# Altium schematic sheet StrongPCB_mixed.SchDoc
size A2
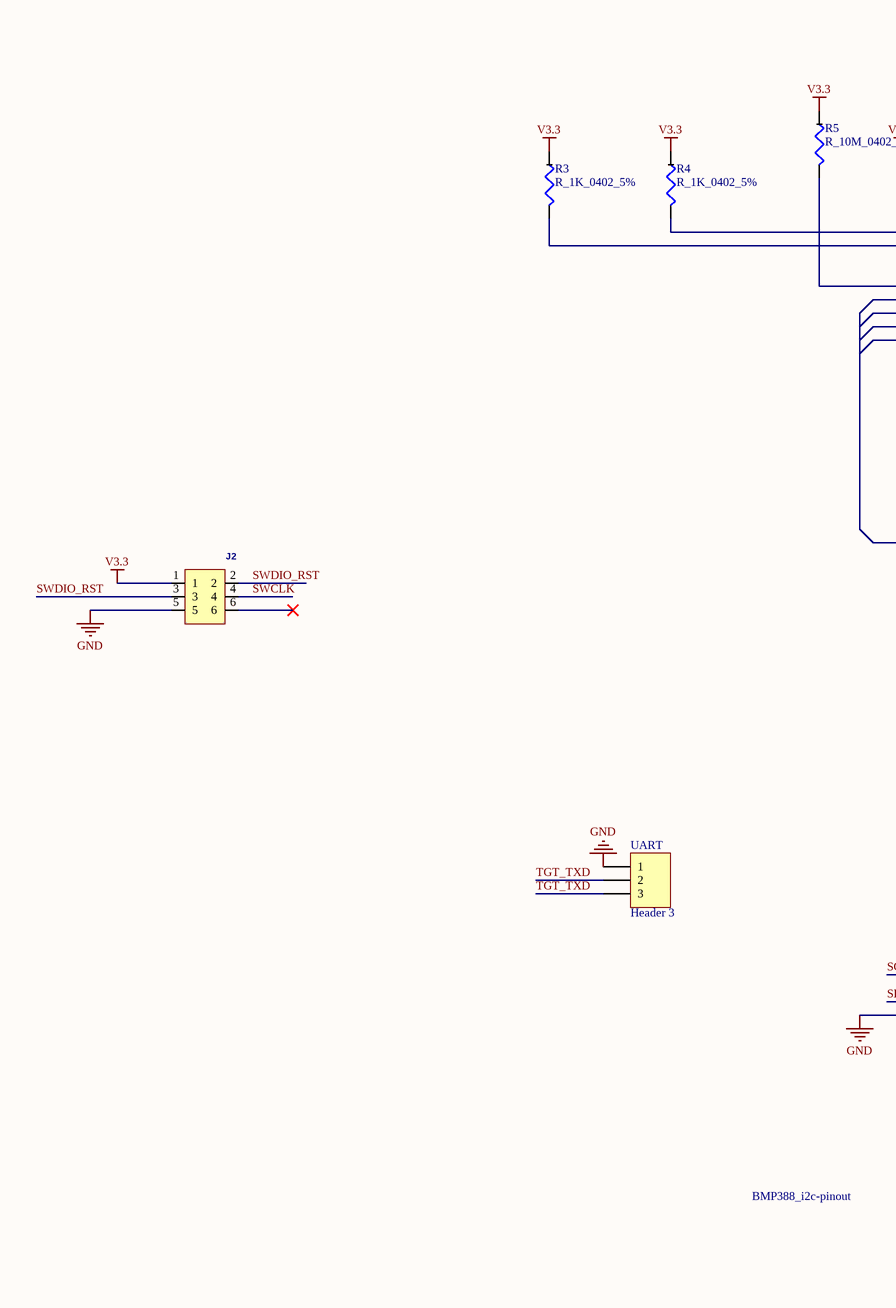
[diagram p0: StrongPCB_mixed.SchDoc, left]
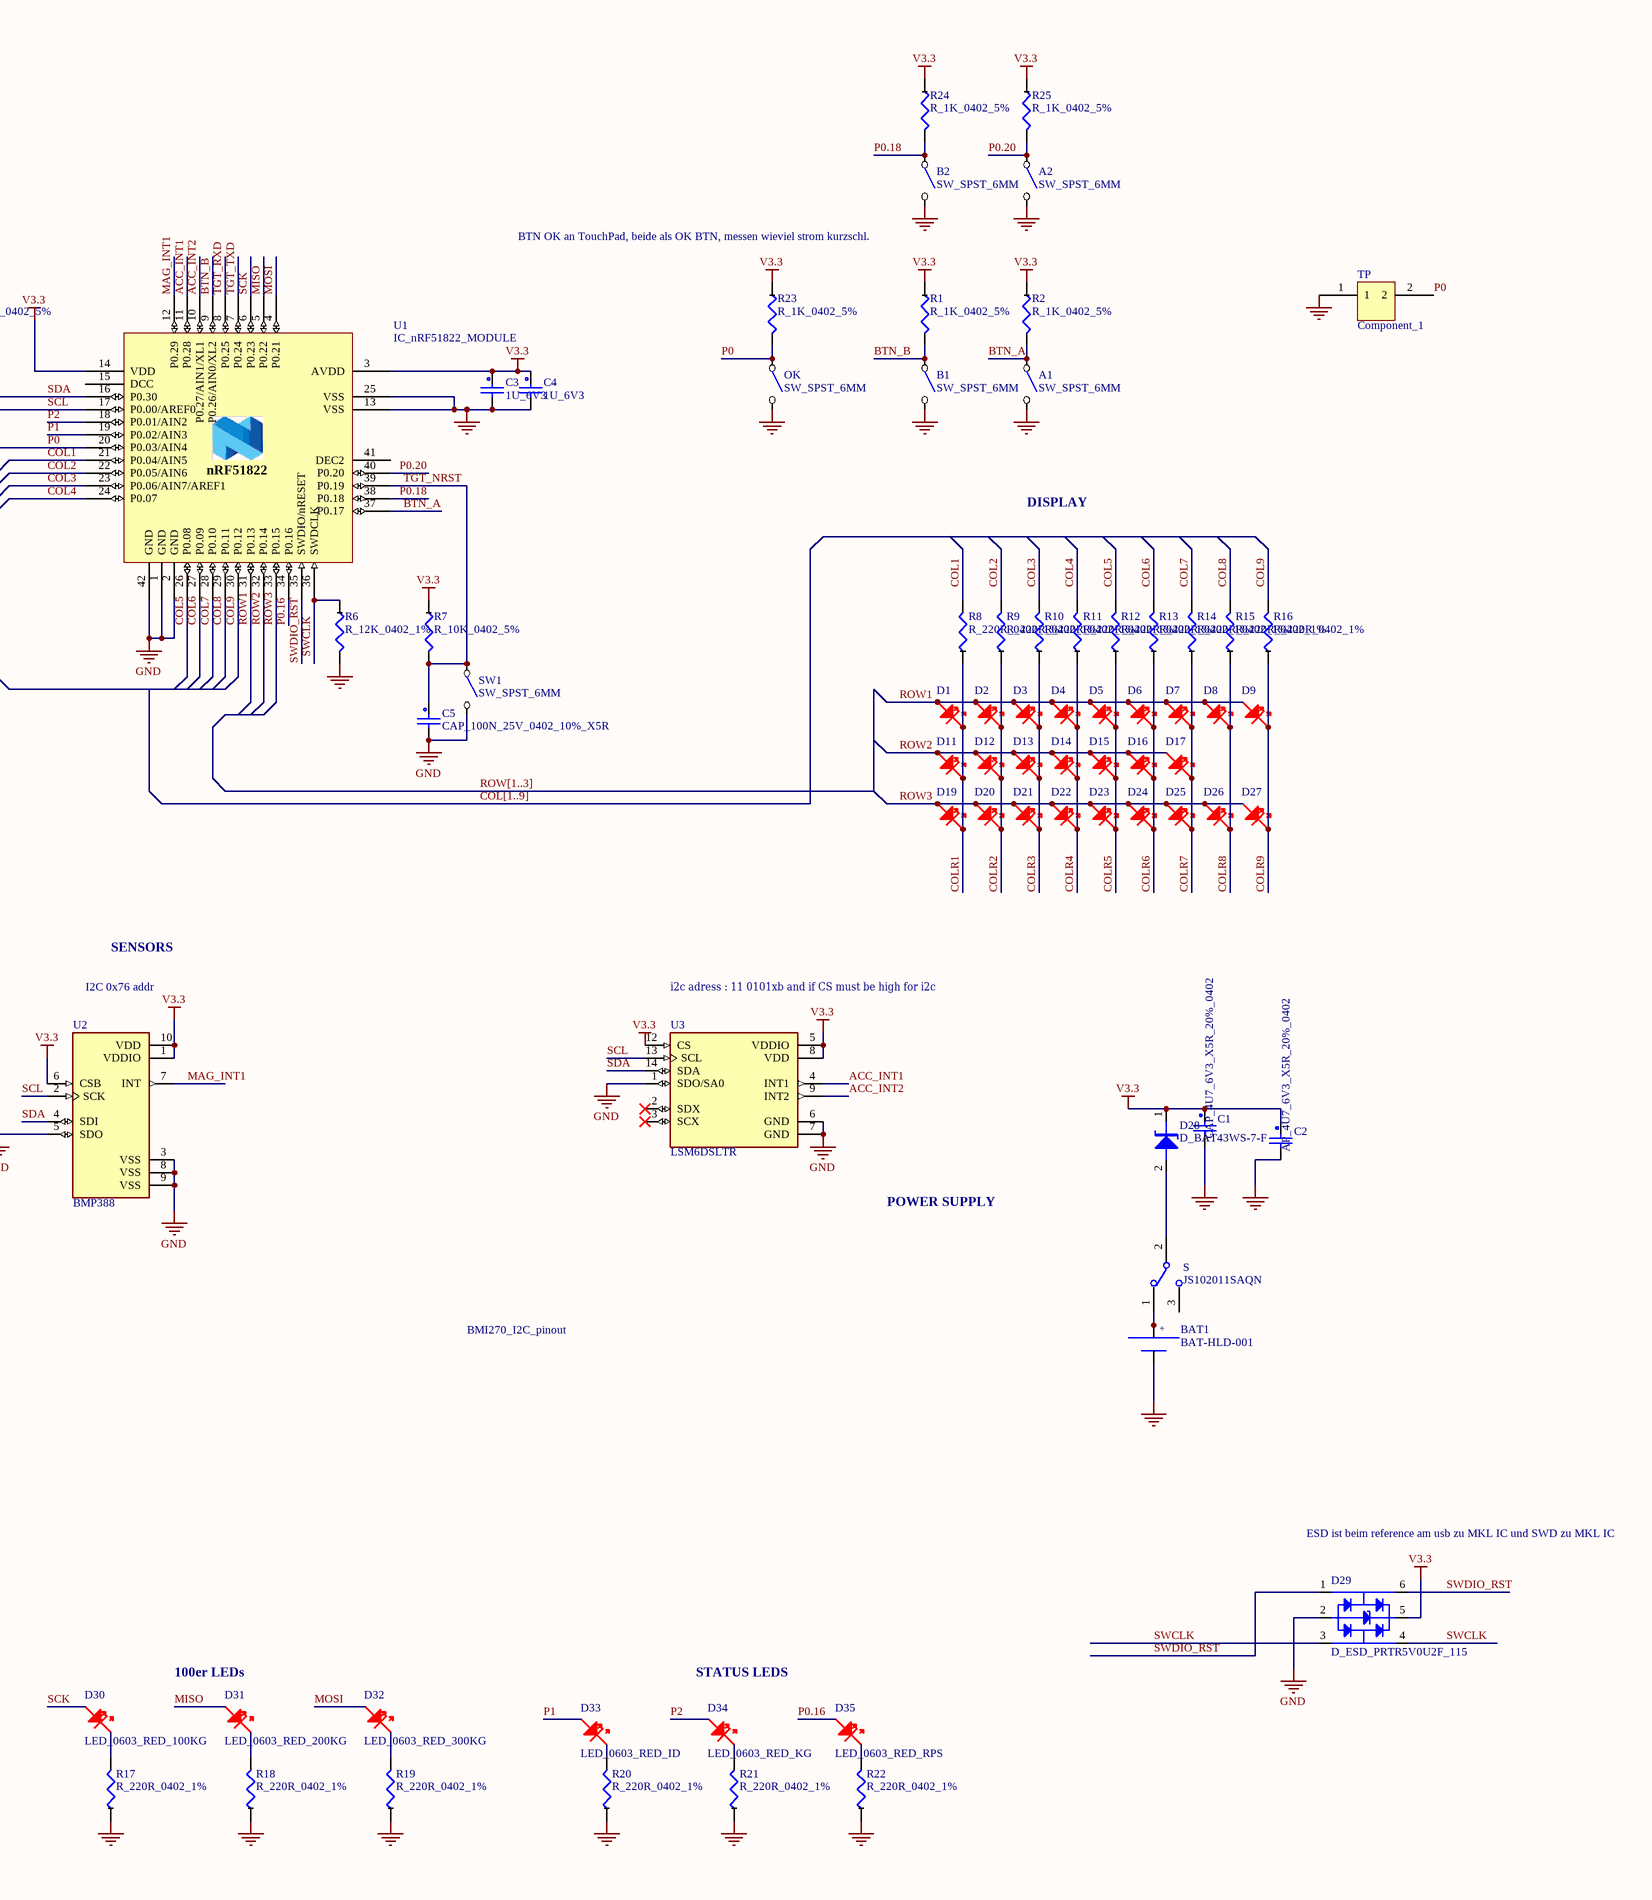
[diagram p1: StrongPCB_mixed.SchDoc, right]

## Parts
A1  SW_SPST_6MM  [SW_FSM4JSMA]
A2  SW_SPST_6MM  [SW_FSM4JSMA]
B1  SW_SPST_6MM  [SW_FSM4JSMA]
B2  SW_SPST_6MM  [SW_FSM4JSMA]
BAT1  BAT-HLD-001  [BAT-HLD-001]
C1  CAP_4U7_6V3_X5R_20%_0402  [c_0402]
C2  AP_4U7_6V3_X5R_20%_0402  [c_0402]
C3  1U_6V3  [C_0402]
C4  1U_6V3  [C_0402]
C5  CAP_100N_25V_0402_10%_X5R  [C_0402]
D1  LED_0603_RED  [LED_0603_RED]  (value not drawn)
D2  LED_0603_RED  [LED_0603_RED]  (value not drawn)
D3  LED_0603_RED  [LED_0603_RED]  (value not drawn)
D4  LED_0603_RED  [LED_0603_RED]  (value not drawn)
D5  LED_0603_RED  [LED_0603_RED]  (value not drawn)
D6  LED_0603_RED  [LED_0603_RED]  (value not drawn)
D7  LED_0603_RED  [LED_0603_RED]  (value not drawn)
D8  LED_0603_RED  [LED_0603_RED]  (value not drawn)
D9  LED_0603_RED  [LED_0603_RED]  (value not drawn)
D11  LED_0603_RED  [LED_0603_RED]  (value not drawn)
D12  LED_0603_RED  [LED_0603_RED]  (value not drawn)
D13  LED_0603_RED  [LED_0603_RED]  (value not drawn)
D14  LED_0603_RED  [LED_0603_RED]  (value not drawn)
D15  LED_0603_RED  [LED_0603_RED]  (value not drawn)
D16  LED_0603_RED  [LED_0603_RED]  (value not drawn)
D17  LED_0603_RED  [LED_0603_RED]  (value not drawn)
D19  LED_0603_RED  [LED_0603_RED]  (value not drawn)
D20  LED_0603_RED  [LED_0603_RED]  (value not drawn)
D21  LED_0603_RED  [LED_0603_RED]  (value not drawn)
D22  LED_0603_RED  [LED_0603_RED]  (value not drawn)
D23  LED_0603_RED  [LED_0603_RED]  (value not drawn)
D24  LED_0603_RED  [LED_0603_RED]  (value not drawn)
D25  LED_0603_RED  [LED_0603_RED]  (value not drawn)
D26  LED_0603_RED  [LED_0603_RED]  (value not drawn)
D27  LED_0603_RED  [LED_0603_RED]  (value not drawn)
D28  D_BAT43WS-7-F  [SOD323]
D29  D_ESD_PRTR5V0U2F_115  [SOT886]
D30  LED_0603_RED_100KG  [LED_0603_RED]
D31  LED_0603_RED_200KG  [LED_0603_RED]
D32  LED_0603_RED_300KG  [LED_0603_RED]
D33  LED_0603_RED_ID  [LED_0603_RED]
D34  LED_0603_RED_KG  [LED_0603_RED]
D35  LED_0603_RED_RPS  [LED_0603_RED]
J2  Sockets & Adapters J-Link 6-pin Needle Adapter   Source:  Datasheet  [J-Link 6-pin Needle Adapter no legs]  (value not drawn)
OK  SW_SPST_6MM  [SW_FSM4JSMA]
R1  R_1K_0402_5%  [R_0402]
R2  R_1K_0402_5%  [R_0402]
R3  R_1K_0402_5%  [R_0402]
R4  R_1K_0402_5%  [R_0402]
R5  R_10M_0402_5%  [R_0402]
R6  R_12K_0402_1%  [R_0402]
R7  R_10K_0402_5%  [R_0402]
R8  R_220R_0402_1%  [R_0402]
R9  R_220R_0402_1%  [R_0402]
R10  R_220R_0402_1%  [R_0402]
R11  R_220R_0402_1%  [R_0402]
R12  R_220R_0402_1%  [R_0402]
R13  R_220R_0402_1%  [R_0402]
R14  R_220R_0402_1%  [R_0402]
R15  R_220R_0402_1%  [R_0402]
R16  R_220R_0402_1%  [R_0402]
R17  R_220R_0402_1%  [R_0402]
R18  R_220R_0402_1%  [R_0402]
R19  R_220R_0402_1%  [R_0402]
R20  R_220R_0402_1%  [R_0402]
R21  R_220R_0402_1%  [R_0402]
R22  R_220R_0402_1%  [R_0402]
R23  R_1K_0402_5%  [R_0402]
R24  R_1K_0402_5%  [R_0402]
R25  R_1K_0402_5%  [R_0402]
S  JS102011SAQN  [SW_JS102011SAQN]
SW1  SW_SPST_6MM  [SW_FSM4JSMA]
TP  Component_1  [PCBComponent_1]
U1  IC_nRF51822_MODULE  [IC_nRF51822_MODULE_PASTE]
U2  BMP388  [PQFN50P200X200X80-10N]
U3  LSM6DSLTR  [PQFN50P300X250X86-14N]
UART  Header 3  [HDR1X3]

## Nets
GND: A1.2 A2.2 B1.2 B2.2 BAT1.NEG C1.2 C2.2 C3.2 C4.2 C5.2 D29.2 J2.5 OK.2 R6.2 R17.1 R18.1 R19.1 R20.1 R21.1 R22.1 SW1.2 TP.1 U1.1(GND) U1.2(GND) U1.13(VSS) U1.25(VSS) U1.42(GND) U2.3(VSS) U2.5(SDO) U2.8(VSS) U2.9(VSS) U3.1(SDO/SA0) U3.6(GND) U3.7(GND) UART.1
V3.3: C1.1 C2.1 C3.1 C4.1 D28.1(K) D29.5 J2.1 R1.1 R2.1 R3.1 R4.1 R5.1 R7.1 R23.1 R24.1 R25.1 U1.3(AVDD) U1.14(VDD) U2.1(VDDIO) U2.6(CSB) U2.10(VDD) U3.5(VDDIO) U3.8(VDD) U3.12(CS)
ACC_INT1: U1.11(P0.28) U3.4(INT1)
ACC_INT2: U1.10(P0.27/AIN1/XL1) U3.9(INT2)
BTN_A: A1.1 R2.2 U1.37(P0.17)
BTN_B: B1.1 R1.2 U1.9(P0.26/AIN0/XL2)
COL1: R8.2 U1.21(P0.04/AIN5)
COL2: R9.2 U1.22(P0.05/AIN6)
COL3: R10.2 U1.23(P0.06/AIN7/AREF1)
COL4: R11.2 U1.24(P0.07)
COL5: R12.2 U1.26(P0.08)
COL6: R13.2 U1.27(P0.09)
COL7: R14.2 U1.28(P0.10)
COL8: R15.2 U1.29(P0.11)
COL9: R16.2 U1.30(P0.12)
COLR1: D1.K D11.K D19.K R8.1
COLR2: D2.K D12.K D20.K R9.1
COLR3: D3.K D13.K D21.K R10.1
COLR4: D4.K D14.K D22.K R11.1
COLR5: D5.K D15.K D23.K R12.1
COLR6: D6.K D16.K D24.K R13.1
COLR7: D7.K D17.K D25.K R14.1
COLR8: D8.K D26.K R15.1
COLR9: D9.K D27.K R16.1
MAG_INT1: U1.12(P0.29) U2.7(INT)
MISO: D31.A U1.5(P0.22)
MOSI: D32.A U1.4(P0.21)
P0: OK.1 R5.2 R23.2 TP.2 U1.20(P0.03/AIN4)
P0.16: D35.A U1.34(P0.16)
P0.18: B2.1 R24.2 U1.38(P0.18)
P0.20: A2.1 R25.2 U1.40(P0.20)
P1: D33.A U1.19(P0.02/AIN3)
P2: D34.A U1.18(P0.01/AIN2)
ROW1: D1.A D2.A D3.A D4.A D5.A D6.A D7.A D8.A D9.A U1.31(P0.13)
ROW2: D11.A D12.A D13.A D14.A D15.A D16.A D17.A U1.32(P0.14)
ROW3: D19.A D20.A D21.A D22.A D23.A D24.A D25.A D26.A D27.A U1.33(P0.15)
SCK: D30.A U1.6(P0.23)
SCL: R3.2 U1.17(P0.00/AREF0) U2.2(SCK) U3.13(SCL)
SDA: R4.2 U1.16(P0.30) U2.4(SDI) U3.14(SDA)
SWCLK: D29.3 D29.4 J2.4 R6.1 U1.36(SWDCLK)
SWDIO_RST: D29.1 D29.6 J2.2 J2.3 U1.35(SWDIO/nRESET)
TGT_NRST: C5.1 R7.2 SW1.1 U1.39(P0.19)
TGT_RXD: U1.8(P0.25)
TGT_TXD: U1.7(P0.24) UART.2 UART.3
NetBAT1_+@1: BAT1.+@1 BAT1.+@2 S.1
NetD28_2: D28.2(A) S.2
NetD30_K: D30.K R17.2
NetD31_K: D31.K R18.2
NetD32_K: D32.K R19.2
NetD33_K: D33.K R20.2
NetD34_K: D34.K R21.2
NetD35_K: D35.K R22.2

Not connected (* = marked no-connect by the designer): J2 6*; S 3; U1 15(DCC) 41(DEC2); U3 2(SDX)* 3(SCX)*

## Buses and harness runs
bus COL[1..9]
bus ROW[1..3]

## Notes on the sheet
- BTN OK an TouchPad, beide als OK BTN, messen wieviel strom kurzschl.
- DISPLAY
- I2C 0x76 addr
- SENSORS
- i2c adress : 11 0101‬xb and if CS must be high for i2c
- POWER SUPPLY
- BMP388_i2c-pinout
- BMI270_I2C_pinout
- ESD ist beim reference am usb zu MKL IC und SWD zu MKL IC
- (near D31) 100er LEDs
- (near D34) STATUS LEDS
- (in symbol BAT-HLD-001) +
- (in symbol IC_nRF51822_MODULE) nRF51822

## Library data of the parts
A1 A2 B1 B2 OK SW1 = SW_SPST_6MM: SPST SWITCH 6MM; PART: FSM4JSMA; MANUFACTURER: TE CONNECTIVITY / ALCOSWITCH; FARNELL: 3801305
BAT1 = BAT-HLD-001: Battery Retainer Coin, 20.0mm 1 Cell SMD _SMT_ Tab; MF: Linx Technologies; Digi-Key_Purchase_URL: https://www.digikey.com/product-detail/en/linx-technologies-inc/BAT-HLD-001-TR/BAT-HLD-001-TRCT-ND/5803803?utm_source=snapeda&utm_medium=aggregator&utm_campaign=symbol; SnapEDA_Link: https://www.snapeda.com/parts/BAT-HLD-001/Linx%20Technologies%20Inc./view-part/184402/?ref=snap; MP: BAT-HLD-001; Value: *; Digi-Key_Part_Number: BAT-HLD-001-TRCT-ND; Package: None
C1 C2 = CAP_4U7_6V3_X5R_20%_0402: PART: C1005X5R0J475M; MANUFACTURER: TDK; FARNELL: 1962109
C3 C4 = CAP_1u_6V3_0402_10%_X6S: MANUFACTURER: YAGEO; PART: CC0402KRX7R7BB104; FARNELL: 9402047RL; MOUSER: 603-CC402KRX7R7BB104; DIGIKEY: 311-1338-6-ND
C5 = CAP_100N_25V_0402_10%_X5R: PART: TMK105BJ104KV-F; MANUFACTURER: TAIYO YUDEN; FARNELL: 1611916
D1-D9 D11-D17 D19-D27 D30-D35 = LED_0603_RED: LED RED 0603; PART: KP-1608SURC; MANUFACTURER: KINGBRIGHT; FARNELL: 8529868RL
D28 = D_BAT43WS-7-F: Schottky 200mA 30V 0.5uA@25Vr; MANUFACTURER: Diodes Incorporated; RS: 751-3364P; FARNELL: 2305998; PART: BAT43WS-7-F; DIGIKEY: BAT43WS-FDICT-ND; MOUSER: 621-BAT43WS-F
D29 = D_ESD_PRTR5V0U2F_115: Ultra low capacitance double rail-to-rail ESD protection; MANUFACTURER: NXP; FARNELL: 2459738; PART: PRTR5V0U2F_115
J2 = J-Link Connector: Manufacturer_Name: Segger Microcontroller; GateName_1: G$1; SymbolName_1: 8.06.16; LibraryName: 8.06.16; DeviceSetName: 8.06.16; Package: 80616; Manufacturer_Part_Number: 8.06.16; Mouser_Part_Number: 943-8.06.16; Mouser_Price-Stock: https://www.mouser.com/Search/Refine.aspx?Keyword=943-8.06.16; Height: 1mm
R5 = R_10M_0402_5%: PART: RC0603FR-0710ML; MANUFACTURER: YAGEO; FARNELL: 9238964RL
S = JS102011SAQN: Slide Switch SPDT Surface Mount, Right Angle; MF: C&K; Availability: Unavailable; Price: None; SnapEDA_Link: https://www.snapeda.com/parts/JS102011SAQN/C%26K/view-part/214325/?ref=snap; Value: *; MP: JS102011SAQN; Package: None
U1 = IC_nRF51822_MODULE: RF System on a Chip - SoC 2.4GHz BT low Energy 256KB Flash 16KB Ram; MANUFACTURER: RAYTAC; PART: MDBT40-256V3; FARNELL: ???
U2 = BMP388: Pressure Sensor 4.35PSI ~ 18.13PSI _30kPa ~ 125kPa_ Absolute 10-WFLGA; MF: Bosch Sensortec; MP: BMP388; Value: *; SnapEDA_Link: https://www.snapeda.com/parts/BMP388/Bosch%20Sensortec/view-part/2747857/?ref=snap; Package: WFLGA-10 Bosch Tools; Digi-Key_Part_Number: 828-1079-1-ND; Digi-Key_Purchase_URL: https://www.digikey.com/product-detail/en/bosch-sensortec/BMP388/828-1079-1-ND/8322640?utm_source=snapeda&utm_medium=aggregator&utm_campaign=symbol
U3 = LSM6DSLTR: Accelerometer, Gyroscope, Temperature, 6 Axis Sensor IÂ²C, SPI Output; MF: STMicroelectronics; SnapEDA_Link: https://www.snapeda.com/parts/LSM6DSLTR/STMicroelectronics/view-part/550517/?ref=snap; Availability: Unavailable; MP: LSM6DSLTR; Value: *; Price: None; Package: LGA-14 STMicroelectronics
UART = Header 3: Header, 3-Pin; LatestRevisionDate: 17-Jul-2002; LatestRevisionNote: Re-released for DXP Platform.; Publisher: Altium Limited
R1-R4 R23-R25 = R_1K_0402_5%: FARNELL_ROHS: *; FARNELL: 1358043
R6 = R_12K_0402_1%: FARNELL_ROHS: 2447104RL; FARNELL: 2447104RL
R7 = R_10K_0402_5%: FARNELL_ROHS: *; FARNELL: 1358069